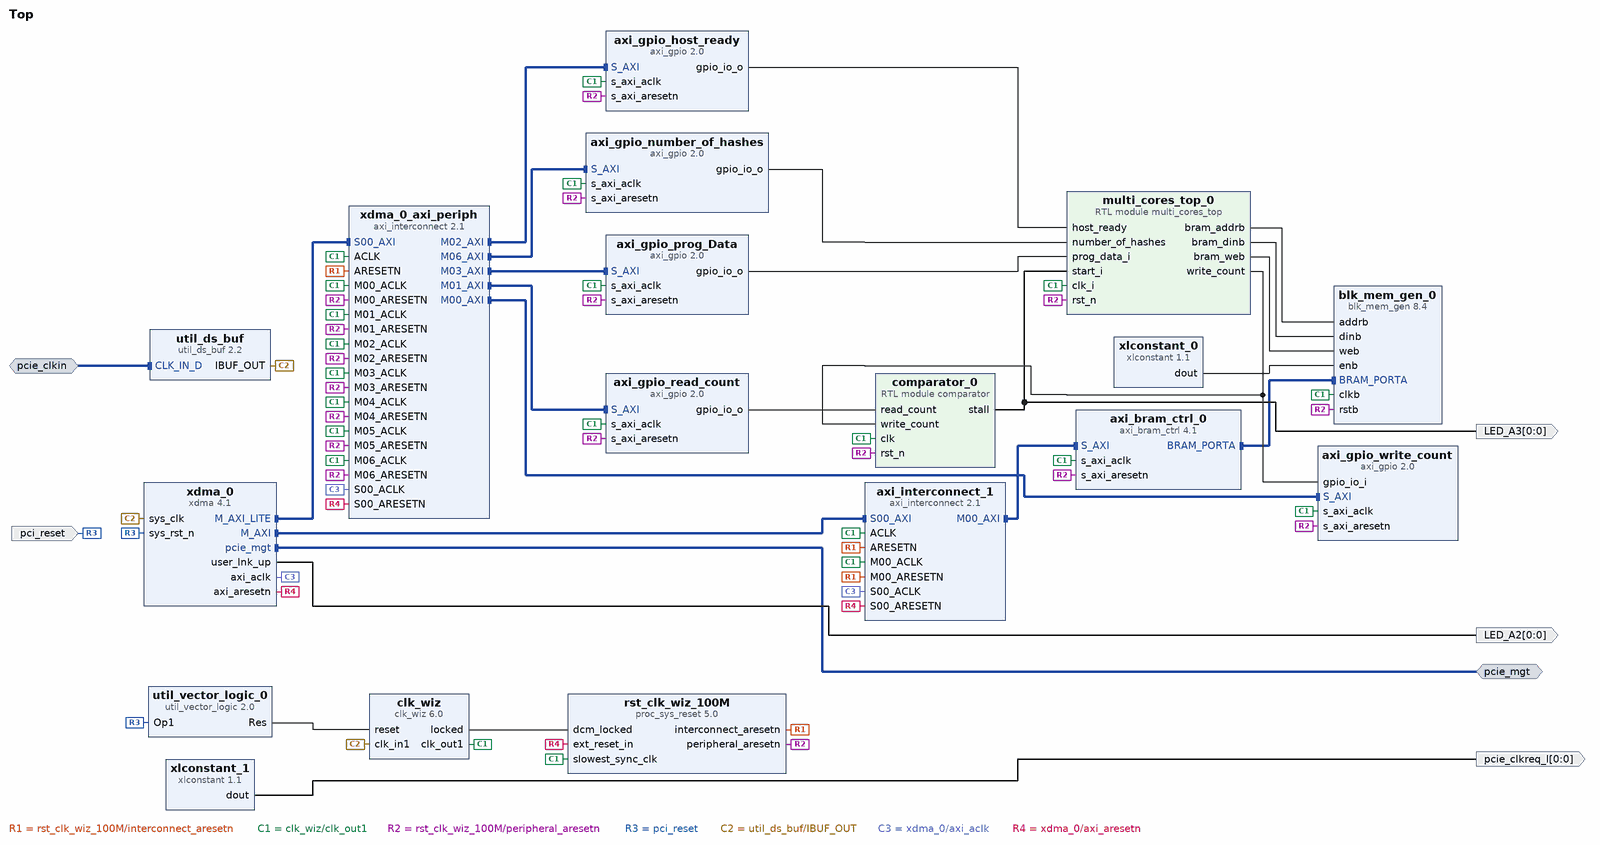
[diagram p0: block diagram of the top level]
# Vivado block design Top, xc7a200tfbg484-2, Vivado 2023.1
create_bd_design Top

create_bd_intf_port -mode Slave -vlnv xilinx.com:interface:diff_clock_rtl:1.0 pcie_clkin
set_property -dict {CONFIG.FREQ_HZ 100000000} [get_bd_intf_ports pcie_clkin]
create_bd_intf_port -mode Master -vlnv xilinx.com:interface:pcie_7x_mgt_rtl:1.0 pcie_mgt
create_bd_port -dir O -from 0 -to 0 LED_A3
create_bd_port -dir I -type rst pci_reset
set_property -dict {CONFIG.POLARITY ACTIVE_LOW} [get_bd_ports pci_reset]
create_bd_port -dir O -from 0 -to 0 pcie_clkreq_l
create_bd_port -dir O -from 0 -to 0 LED_A2

create_bd_cell -type ip -vlnv xilinx.com:ip:xlconstant:1.1 xlconstant_1
set_property -dict {CONFIG.CONST_VAL 0} [get_bd_cells xlconstant_1]
create_bd_cell -type ip -vlnv xilinx.com:ip:axi_interconnect:2.1 axi_interconnect_1
set_property -dict {CONFIG.ENABLE_ADVANCED_OPTIONS 0 CONFIG.NUM_MI 1} [get_bd_cells axi_interconnect_1]
create_bd_cell -type ip -vlnv xilinx.com:ip:util_ds_buf:2.2 util_ds_buf
set_property -dict {CONFIG.C_BUF_TYPE IBUFDSGTE} [get_bd_cells util_ds_buf]
create_bd_cell -type ip -vlnv xilinx.com:ip:xdma:4.1 xdma_0
set_property -dict [list \
  CONFIG.PF0_DEVICE_ID_mqdma 9024 \
  CONFIG.PF0_SRIOV_VF_DEVICE_ID 0000 \
  CONFIG.PF2_DEVICE_ID_mqdma 9024 \
  CONFIG.PF3_DEVICE_ID_mqdma 9024 \
  CONFIG.axi_data_width 128_bit \
  CONFIG.axil_master_64bit_en true \
  CONFIG.axil_master_prefetchable true \
  CONFIG.axilite_master_en true \
  CONFIG.axilite_master_scale Kilobytes \
  CONFIG.axilite_master_size 128 \
  CONFIG.axisten_freq 125 \
  CONFIG.cfg_mgmt_if false \
  CONFIG.copy_pf0 true \
  CONFIG.en_ext_ch_gt_drp false \
  CONFIG.en_pcie_drp false \
  CONFIG.en_transceiver_status_ports false \
  CONFIG.enable_gen4 false \
  CONFIG.mode_selection Advanced \
  CONFIG.pf0_Use_Class_Code_Lookup_Assistant false \
  CONFIG.pf0_base_class_menu Device_was_built_before_Class_Code_definitions_were_finalized \
  CONFIG.pf0_class_code_base 12 \
  CONFIG.pf0_class_code_interface 00 \
  CONFIG.pf0_class_code_sub 00 \
  CONFIG.pf0_device_id 903f \
  CONFIG.pf0_sub_class_interface_menu All_currently_implemented_devices_except_VGA-compatible_devices \
  CONFIG.pf0_subsystem_id 0 \
  CONFIG.pf0_subsystem_vendor_id 0 \
  CONFIG.pl_link_cap_max_link_speed 5.0_GT/s \
  CONFIG.pl_link_cap_max_link_width X4 \
  CONFIG.plltype QPLL1 \
  CONFIG.runbit_fix false \
  CONFIG.vendor_id 10EE \
  CONFIG.xdma_axi_intf_mm AXI_Memory_Mapped \
  CONFIG.xdma_pcie_64bit_en true \
  CONFIG.xdma_pcie_prefetchable true \
  CONFIG.xdma_rnum_chnl 1 \
  CONFIG.xdma_sts_ports false \
  CONFIG.xdma_wnum_chnl 1 \
] [get_bd_cells xdma_0]
create_bd_cell -type ip -vlnv xilinx.com:ip:axi_interconnect:2.1 xdma_0_axi_periph
set_property -dict {CONFIG.NUM_MI 7} [get_bd_cells xdma_0_axi_periph]
create_bd_cell -type ip -vlnv xilinx.com:ip:axi_bram_ctrl:4.1 axi_bram_ctrl_0
set_property -dict {CONFIG.DATA_WIDTH 128 CONFIG.SINGLE_PORT_BRAM 1} [get_bd_cells axi_bram_ctrl_0]
create_bd_cell -type ip -vlnv xilinx.com:ip:blk_mem_gen:8.4 blk_mem_gen_0
set_property -dict [list \
  CONFIG.Assume_Synchronous_Clk false \
  CONFIG.EN_SAFETY_CKT true \
  CONFIG.Enable_32bit_Address true \
  CONFIG.Memory_Type True_Dual_Port_RAM \
  CONFIG.use_bram_block BRAM_Controller \
] [get_bd_cells blk_mem_gen_0]
create_bd_cell -type ip -vlnv xilinx.com:ip:axi_gpio:2.0 axi_gpio_read_count
set_property -dict {CONFIG.C_ALL_OUTPUTS 1 CONFIG.C_GPIO_WIDTH 32} [get_bd_cells axi_gpio_read_count]
create_bd_cell -type ip -vlnv xilinx.com:ip:axi_gpio:2.0 axi_gpio_write_count
set_property -dict {CONFIG.C_ALL_INPUTS 1 CONFIG.C_GPIO_WIDTH 32} [get_bd_cells axi_gpio_write_count]
create_bd_cell -type ip -vlnv xilinx.com:ip:proc_sys_reset:5.0 rst_clk_wiz_100M
create_bd_cell -type ip -vlnv xilinx.com:ip:clk_wiz:6.0 clk_wiz
set_property -dict [list \
  CONFIG.CLKIN1_JITTER_PS 100.0 \
  CONFIG.CLKOUT1_JITTER 130.958 \
  CONFIG.CLKOUT1_PHASE_ERROR 98.575 \
  CONFIG.CLKOUT1_REQUESTED_OUT_FREQ 100.000 \
  CONFIG.MMCM_CLKFBOUT_MULT_F 10.000 \
  CONFIG.MMCM_CLKIN1_PERIOD 10.000 \
  CONFIG.MMCM_CLKOUT0_DIVIDE_F 10.000 \
  CONFIG.MMCM_DIVCLK_DIVIDE 1 \
  CONFIG.PRIM_IN_FREQ 100.000 \
] [get_bd_cells clk_wiz]
create_bd_cell -type ip -vlnv xilinx.com:ip:util_vector_logic:2.0 util_vector_logic_0
set_property -dict {CONFIG.C_OPERATION not} [get_bd_cells util_vector_logic_0]
create_bd_cell -type ip -vlnv xilinx.com:ip:axi_gpio:2.0 axi_gpio_host_ready
set_property -dict {CONFIG.C_ALL_OUTPUTS 1 CONFIG.C_GPIO_WIDTH 1} [get_bd_cells axi_gpio_host_ready]
create_bd_cell -type ip -vlnv xilinx.com:ip:axi_gpio:2.0 axi_gpio_prog_Data
set_property -dict {CONFIG.C_ALL_OUTPUTS 1} [get_bd_cells axi_gpio_prog_Data]
create_bd_cell -type ip -vlnv xilinx.com:ip:xlconstant:1.1 xlconstant_0
create_bd_cell -type ip -vlnv xilinx.com:ip:axi_gpio:2.0 axi_gpio_number_of_hashes
set_property -dict {CONFIG.C_ALL_OUTPUTS 1 CONFIG.C_GPIO_WIDTH 4} [get_bd_cells axi_gpio_number_of_hashes]
create_bd_cell -type module -reference comparator comparator_0
create_bd_cell -type module -reference multi_cores_top multi_cores_top_0
set_property -dict [list \
  CONFIG.BRAM_DEPTH 1024 \
  CONFIG.EXP_PWD_SIZE 80 \
  CONFIG.NUM_CORES 16 \
  CONFIG.PWD_SIZE 5 \
] [get_bd_cells multi_cores_top_0]

# ---- connections ----

connect_bd_intf_net [get_bd_intf_pins blk_mem_gen_0/BRAM_PORTA] [get_bd_intf_pins axi_bram_ctrl_0/BRAM_PORTA]
connect_bd_intf_net [get_bd_intf_pins axi_interconnect_1/M00_AXI] [get_bd_intf_pins axi_bram_ctrl_0/S_AXI]
connect_bd_intf_net -intf_net diff_clock_rtl_0_1 [get_bd_intf_ports pcie_clkin] [get_bd_intf_pins util_ds_buf/CLK_IN_D]
connect_bd_intf_net [get_bd_intf_pins axi_interconnect_1/S00_AXI] [get_bd_intf_pins xdma_0/M_AXI]
connect_bd_intf_net [get_bd_intf_pins xdma_0/M_AXI_LITE] [get_bd_intf_pins xdma_0_axi_periph/S00_AXI]
connect_bd_intf_net [get_bd_intf_pins xdma_0_axi_periph/M00_AXI] [get_bd_intf_pins axi_gpio_write_count/S_AXI]
connect_bd_intf_net [get_bd_intf_pins xdma_0_axi_periph/M01_AXI] [get_bd_intf_pins axi_gpio_read_count/S_AXI]
connect_bd_intf_net [get_bd_intf_pins xdma_0_axi_periph/M02_AXI] [get_bd_intf_pins axi_gpio_host_ready/S_AXI]
connect_bd_intf_net [get_bd_intf_pins xdma_0_axi_periph/M03_AXI] [get_bd_intf_pins axi_gpio_prog_Data/S_AXI]
connect_bd_intf_net [get_bd_intf_pins xdma_0_axi_periph/M06_AXI] [get_bd_intf_pins axi_gpio_number_of_hashes/S_AXI]
connect_bd_intf_net [get_bd_intf_ports pcie_mgt] [get_bd_intf_pins xdma_0/pcie_mgt]
connect_bd_net -net ARESETN_1 [get_bd_pins rst_clk_wiz_100M/interconnect_aresetn] \
  [get_bd_pins xdma_0_axi_periph/ARESETN] [get_bd_pins axi_interconnect_1/M00_ARESETN] \
  [get_bd_pins axi_interconnect_1/ARESETN]
connect_bd_net -net M01_ACLK_1 [get_bd_pins clk_wiz/clk_out1] \
  [get_bd_pins axi_interconnect_1/M00_ACLK] [get_bd_pins axi_bram_ctrl_0/s_axi_aclk] \
  [get_bd_pins rst_clk_wiz_100M/slowest_sync_clk] [get_bd_pins axi_interconnect_1/ACLK] [get_bd_pins xdma_0_axi_periph/ACLK] \
  [get_bd_pins xdma_0_axi_periph/M02_ACLK] [get_bd_pins axi_gpio_read_count/s_axi_aclk] \
  [get_bd_pins xdma_0_axi_periph/M01_ACLK] [get_bd_pins axi_gpio_write_count/s_axi_aclk] \
  [get_bd_pins xdma_0_axi_periph/M00_ACLK] [get_bd_pins axi_gpio_host_ready/s_axi_aclk] \
  [get_bd_pins axi_gpio_prog_Data/s_axi_aclk] [get_bd_pins xdma_0_axi_periph/M03_ACLK] \
  [get_bd_pins xdma_0_axi_periph/M04_ACLK] [get_bd_pins xdma_0_axi_periph/M05_ACLK] [get_bd_pins blk_mem_gen_0/clkb] \
  [get_bd_pins axi_gpio_number_of_hashes/s_axi_aclk] [get_bd_pins xdma_0_axi_periph/M06_ACLK] [get_bd_pins comparator_0/clk] \
  [get_bd_pins multi_cores_top_0/clk_i]
connect_bd_net -net M02_ARESETN_1 [get_bd_pins rst_clk_wiz_100M/peripheral_aresetn] \
  [get_bd_pins xdma_0_axi_periph/M02_ARESETN] [get_bd_pins xdma_0_axi_periph/M01_ARESETN] \
  [get_bd_pins xdma_0_axi_periph/M00_ARESETN] [get_bd_pins axi_gpio_read_count/s_axi_aresetn] \
  [get_bd_pins axi_gpio_host_ready/s_axi_aresetn] [get_bd_pins axi_bram_ctrl_0/s_axi_aresetn] \
  [get_bd_pins axi_gpio_prog_Data/s_axi_aresetn] [get_bd_pins xdma_0_axi_periph/M03_ARESETN] \
  [get_bd_pins xdma_0_axi_periph/M04_ARESETN] [get_bd_pins xdma_0_axi_periph/M05_ARESETN] [get_bd_pins blk_mem_gen_0/rstb] \
  [get_bd_pins axi_gpio_write_count/s_axi_aresetn] [get_bd_pins axi_gpio_number_of_hashes/s_axi_aresetn] \
  [get_bd_pins xdma_0_axi_periph/M06_ARESETN] [get_bd_pins comparator_0/rst_n] [get_bd_pins multi_cores_top_0/rst_n]
connect_bd_net -net axi_gpio_2_host_Ready [get_bd_pins axi_gpio_host_ready/gpio_io_o] [get_bd_pins multi_cores_top_0/host_ready]
connect_bd_net -net axi_gpio_6_gpio_io_o [get_bd_pins axi_gpio_number_of_hashes/gpio_io_o] [get_bd_pins multi_cores_top_0/number_of_hashes]
connect_bd_net -net axi_gpio_prog_data_i [get_bd_pins axi_gpio_prog_Data/gpio_io_o] [get_bd_pins multi_cores_top_0/prog_data_i]
connect_bd_net [get_bd_pins axi_gpio_read_count/gpio_io_o] [get_bd_pins comparator_0/read_count]
connect_bd_net [get_bd_pins clk_wiz/locked] [get_bd_pins rst_clk_wiz_100M/dcm_locked]
connect_bd_net [get_bd_pins comparator_0/stall] [get_bd_ports LED_A3] [get_bd_pins multi_cores_top_0/start_i]
connect_bd_net [get_bd_pins multi_cores_top_0/bram_addrb] [get_bd_pins blk_mem_gen_0/addrb]
connect_bd_net [get_bd_pins multi_cores_top_0/bram_dinb] [get_bd_pins blk_mem_gen_0/dinb]
connect_bd_net [get_bd_pins multi_cores_top_0/bram_web] [get_bd_pins blk_mem_gen_0/web]
connect_bd_net [get_bd_pins multi_cores_top_0/write_count] [get_bd_pins axi_gpio_write_count/gpio_io_i] [get_bd_pins comparator_0/write_count]
connect_bd_net [get_bd_ports pci_reset] [get_bd_pins xdma_0/sys_rst_n] [get_bd_pins util_vector_logic_0/Op1]
connect_bd_net [get_bd_pins util_ds_buf/IBUF_OUT] [get_bd_pins xdma_0/sys_clk] [get_bd_pins clk_wiz/clk_in1]
connect_bd_net [get_bd_pins util_vector_logic_0/Res] [get_bd_pins clk_wiz/reset]
connect_bd_net [get_bd_pins xdma_0/axi_aclk] [get_bd_pins axi_interconnect_1/S00_ACLK] [get_bd_pins xdma_0_axi_periph/S00_ACLK]
connect_bd_net [get_bd_pins xdma_0/axi_aresetn] \
  [get_bd_pins rst_clk_wiz_100M/ext_reset_in] [get_bd_pins xdma_0_axi_periph/S00_ARESETN] \
  [get_bd_pins axi_interconnect_1/S00_ARESETN]
connect_bd_net [get_bd_pins xdma_0/user_lnk_up] [get_bd_ports LED_A2]
connect_bd_net [get_bd_pins xlconstant_0/dout] [get_bd_pins blk_mem_gen_0/enb]
connect_bd_net [get_bd_pins xlconstant_1/dout] [get_bd_ports pcie_clkreq_l]

# ---- address map ----
assign_bd_address -offset 0x00000000C0000000 -range 16K -target_address_space [get_bd_addr_spaces xdma_0/M_AXI] [get_bd_addr_segs axi_bram_ctrl_0/S_AXI/Mem0]
assign_bd_address -offset 0x00000000 -range 8K -target_address_space [get_bd_addr_spaces xdma_0/M_AXI_LITE] [get_bd_addr_segs axi_gpio_read_count/S_AXI/Reg]
assign_bd_address -offset 0x00002000 -range 8K -target_address_space [get_bd_addr_spaces xdma_0/M_AXI_LITE] [get_bd_addr_segs axi_gpio_write_count/S_AXI/Reg]
assign_bd_address -offset 0x00004000 -range 8K -target_address_space [get_bd_addr_spaces xdma_0/M_AXI_LITE] [get_bd_addr_segs axi_gpio_host_ready/S_AXI/Reg]
assign_bd_address -offset 0x00006000 -range 8K -target_address_space [get_bd_addr_spaces xdma_0/M_AXI_LITE] [get_bd_addr_segs axi_gpio_prog_Data/S_AXI/Reg]
assign_bd_address -offset 0x0000A000 -range 8K -target_address_space [get_bd_addr_spaces xdma_0/M_AXI_LITE] [get_bd_addr_segs axi_gpio_number_of_hashes/S_AXI/Reg]

validate_bd_design
save_bd_design
